# Altium schematic sheet Audio ADC.SchDoc: Vazquez Gonzalez Erick
size Letter; DrawnBy: Vazquez Gonzalez Erick; Revision: 1.0; SheetTotal: 1
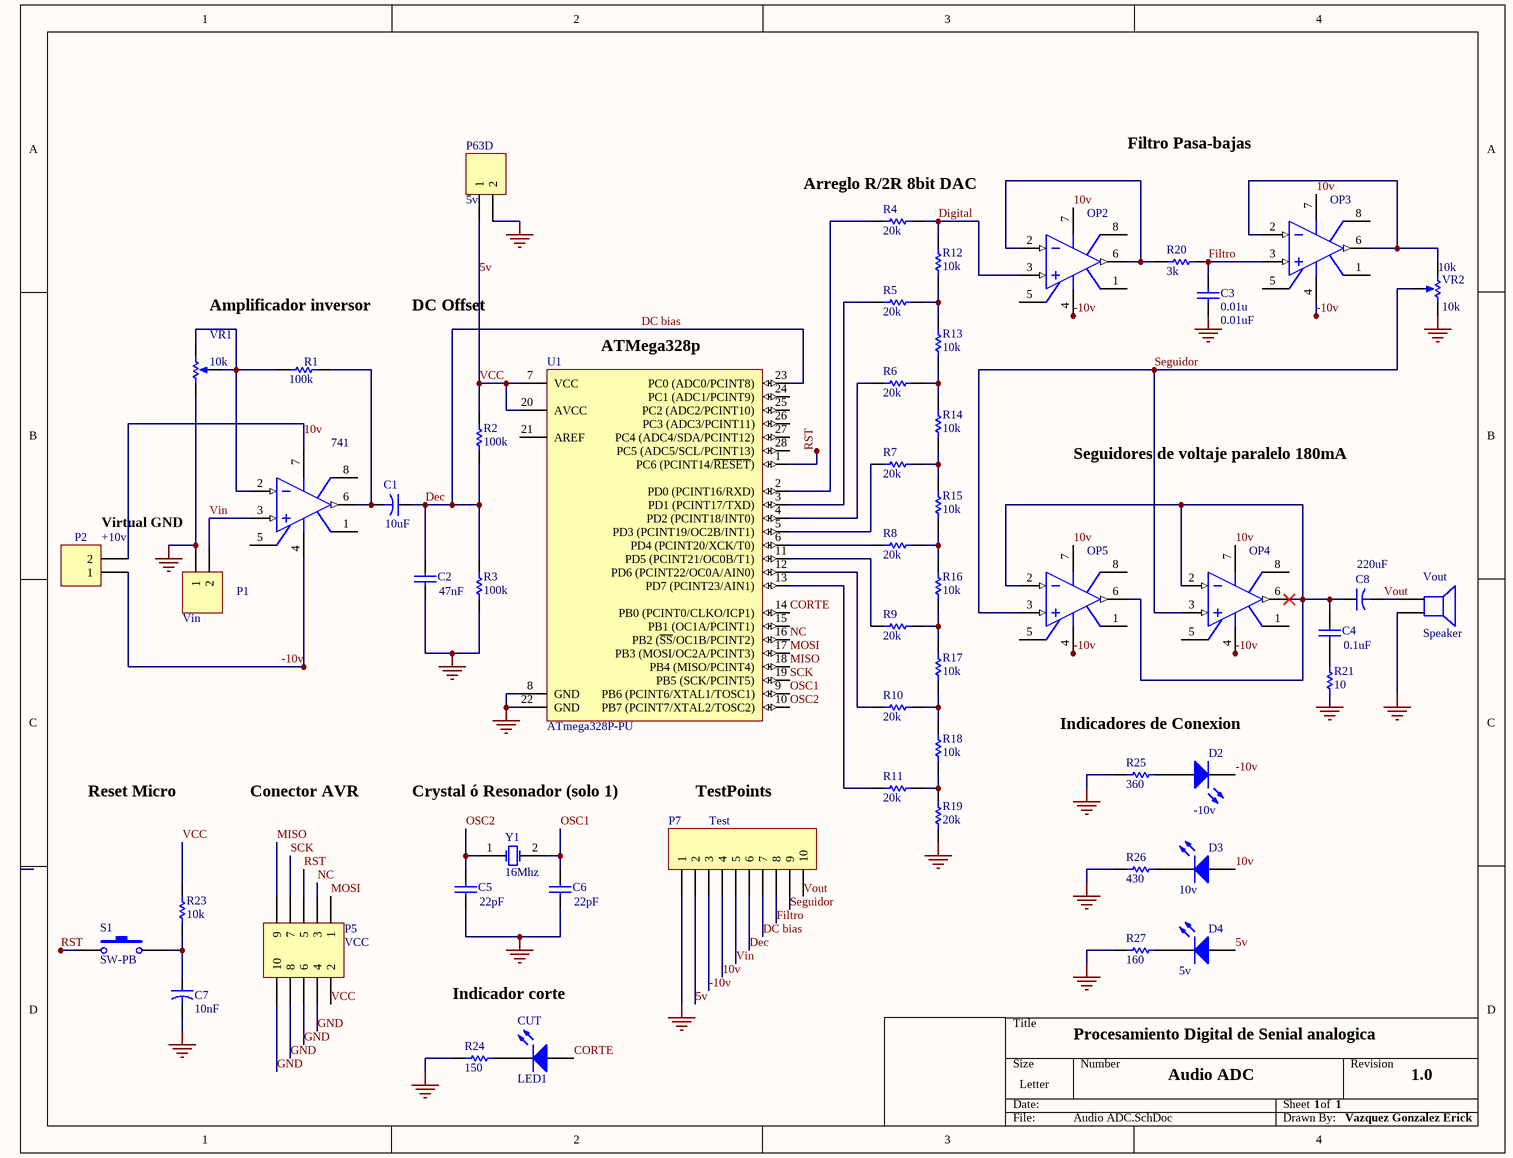
[diagram p0: Audio ADC.SchDoc]

## Parts
C1  value 10uF  [CAPR5-4X5]  (hidden comment: 10u)
C2  value 47nF  [RAD-0.2]  (hidden comment: Cap)
C3  0.01u  value 0.01uF  [RAD-0.1]
C4  value 0.1uF  [RAD-0.1]  (hidden comment: Cap)
C5  value 22pF  [RAD-0.1]  (hidden comment: 22n)
C6  value 22pF  [RAD-0.1]  (hidden comment: 22n)
C7  value 10nF  [CAPR5-4X5]  (hidden comment: 10n)
C8  value 220uF  [CAPR5-4X5]  (hidden comment: 220u)
CUT  LED1  [6-0805_M]
D2  -10v  [6-0805_M]
D3  10v  [6-0805_M]
D4  5v  [6-0805_M]
OP1  741  [DIP-8]
OP2  741  [DIP-8]  (value not drawn)
OP3  741  [DIP-8]  (value not drawn)
OP4  741  [DIP-8]  (value not drawn)
OP5  741  [DIP-8]  (value not drawn)
P1  Vin  [cONECTOR]
P2  +10v  [cONECTOR]
P5  VCC  [HDR2X5]
P7  Test  [HDR1X10]
P63D  5v  [cONECTOR]
R1  100k  [AXIAL-0.3]
R2  100k  [AXIAL-0.3]
R3  100k  [AXIAL-0.3]
R4  20k  [AXIAL-0.3]
R5  20k  [AXIAL-0.3]
R6  20k  [AXIAL-0.3]
R7  20k  [AXIAL-0.3]
R8  20k  [AXIAL-0.3]
R9  20k  [AXIAL-0.3]
R10  20k  [AXIAL-0.3]
R11  20k  [AXIAL-0.3]
R12  10k  [AXIAL-0.3]
R13  10k  [AXIAL-0.3]
R14  10k  [AXIAL-0.3]
R15  10k  [AXIAL-0.3]
R16  10k  [AXIAL-0.3]
R17  10k  [AXIAL-0.3]
R18  10k  [AXIAL-0.3]
R19  20k  [AXIAL-0.3]
R20  3k  [AXIAL-0.3]
R21  10  [AXIAL-0.3]
R23  10k  [AXIAL-0.3]
R24  150  [6-0805_M]
R25  360  [6-0805_M]
R26  430  [6-0805_M]
R27  160  [6-0805_M]
S1  SW-PB  [PBUniversal]
U1  ATmega328P-PU  [28P3]
Vout  Speaker  [cONECTOR]
VR1  10k  [TPParado]
VR2  10k  [TPParado]
Y1  16Mhz  [Crystal]

## Nets
GND: C2.1 C3.1 C5.1 C6.1 C7.2 P1.1 P5.4 P5.6 P5.8 P5.10 P7.1 P63D.2 R3.1 R19.1 R21.1 R24.1 R25.1 R26.1 R27.1 U1.8(GND) U1.22(GND) Vout.2 VR1.1(TOP) VR2.2(BOT)
5v: D4.1(A) P5.2 P7.2 P63D.1 R2.2 R23.1 U1.7(VCC) U1.20(AVCC)  [also labelled VCC]
10v: D3.1(A) OP1.7(V+) OP2.7(V+) OP3.7(V+) OP4.7(V+) OP5.7(V+) P2.2 P7.4
-10v: D2.2(K) OP1.4(V-) OP2.4(V-) OP3.4(V-) OP4.4(V-) OP5.4(V-) P2.1 P7.3
CORTE: CUT.1(A) U1.14(PB0_(PCINT0/CLKO/ICP1))
DC bias: C1.1 C2.2 P7.6 P7.7 R2.1 R3.2 U1.23(PC0_(ADC0/PCINT8))  [also labelled Dec]
Digital: OP2.3(IN+) R4.2 R12.2
Filtro: C3.2 OP3.3(IN+) P7.8 R20.1
MISO: P5.9 U1.18(PB4_(MISO/PCINT4))
MOSI: P5.1 U1.17(PB3_(MOSI/OC2A/PCINT3))
NC: P5.3 U1.16(PB2_(~{SS}/OC1B/PCINT2))
OSC1: C6.2 U1.9(PB6_(PCINT6/XTAL1/TOSC1)) Y1.2(OSC2)
OSC2: C5.2 U1.10(PB7_(PCINT7/XTAL2/TOSC2)) Y1.1(OSC1)
RST: P5.5 S1.1 U1.1(PC6_(PCINT14/~{RESET}))
SCK: P5.7 U1.19(PB5_(SCK/PCINT5))
Seguidor: OP4.3(IN+) OP5.3(IN+) P7.9 VR2.3(TAP)
Vin: OP1.3(IN+) P1.2 P7.5
Vout: C8.2 P7.10 Vout.1
NetC1_2: C1.2 OP1.6(OUT) R1.2
NetC4_1: C4.1 C8.1 OP4.2(IN-) OP4.6(OUT) OP5.2(IN-) OP5.6(OUT)
NetC4_2: C4.2 R21.2
NetC7_1: C7.1 R23.2 S1.2
NetCUT_2: CUT.2(K) R24.2
NetD2_1: D2.1(A) R25.2
NetD3_2: D3.2(K) R26.2
NetD4_2: D4.2(K) R27.2
NetOP1_2: OP1.2(IN-) R1.1 VR1.2(BOT) VR1.3(TAP)
NetOP2_2: OP2.2(IN-) OP2.6(OUT) R20.2
NetOP3_2: OP3.2(IN-) OP3.6(OUT) VR2.1(TOP)
NetR4_1: R4.1 U1.2(PD0_(PCINT16/RXD))
NetR5_1: R5.1 U1.3(PD1_(PCINT17/TXD))
NetR5_2: R5.2 R12.1 R13.2
NetR6_1: R6.1 U1.4(PD2_(PCINT18/INT0))
NetR6_2: R6.2 R13.1 R14.2
NetR7_1: R7.1 U1.5(PD3_(PCINT19/OC2B/INT1))
NetR7_2: R7.2 R14.1 R15.2
NetR8_1: R8.1 U1.6(PD4_(PCINT20/XCK/T0))
NetR8_2: R8.2 R15.1 R16.2
NetR9_1: R9.1 U1.11(PD5_(PCINT21/OC0B/T1))
NetR9_2: R9.2 R16.1 R17.2
NetR10_1: R10.1 U1.12(PD6_(PCINT22/OC0A/AIN0))
NetR10_2: R10.2 R17.1 R18.2
NetR11_1: R11.1 U1.13(PD7_(PCINT23/AIN1))
NetR11_2: R11.2 R18.1 R19.2

Not connected (* = marked no-connect by the designer): OP1 1(OS_NUL) 5(OS_NUL) 8(TAB); OP2 1(OS_NUL) 5(OS_NUL) 8(TAB); OP3 1(OS_NUL) 5(OS_NUL) 8(TAB); OP4 1(OS_NUL) 5(OS_NUL) 8(TAB); OP5 1(OS_NUL) 5(OS_NUL) 8(TAB); U1 15(PB1_(OC1A/PCINT1)) 21(AREF) 24(PC1_(ADC1/PCINT9)) 25(PC2_(ADC2/PCINT10)) 26(PC3_(ADC3/PCINT11)) 27(PC4_(ADC4/SDA/PCINT12)) 28(PC5_(ADC5/SCL/PCINT13))

## Notes on the sheet
- Filtro Pasa-bajas
- (near R4) Arreglo R/2R 8bit DAC
- Amplificador inversor
- DC Offset
- (near U1) ATMega328p
- Seguidores de voltaje paralelo 180mA
- Virtual GND
- Indicadores de Conexion
- Reset Micro
- Conector AVR
- Crystal ó Resonador (solo 1)
- TestPoints
- Indicador corte
- Procesamiento Digital de Senial analogica
- Audio ADC
- 1
- 1.0
- Vazquez Gonzalez Erick

## Library data of the parts
C1 C7 C8 = Cap2: Capacitor; Published: 23-Sep-2002; PackageReference: CAPR5-4X5; Publisher: Altium Limited; PackageDescription: Capacitor; 2 Leads
C2-C6 = Cap: Capacitor; Published: 8-Jun-2000; LatestRevisionDate: 17-Jul-2002; LatestRevisionNote: Re-released for DXP Platform.; PackageReference: RAD-0.3; Publisher: Altium Limited; PackageDescription: Radial Cap, Thru-Hole; 2 Leads; 0.3 in Pin Spacing
CUT D2-D4 = LED1: Typical RED GaAs LED; Published: 8-Jun-2000; LatestRevisionDate: 08-Jul-2005; LatestRevisionNote: Mech Layer 1 removed.; PackageReference: LED-1; Publisher: Altium Limited; PackageDescription: LED; 2 Leads
OP1-OP5 = Op Amp: FET Operational Amplifier; Published: 8-Jun-2000; LatestRevisionDate: 17-Jul-2002; LatestRevisionNote: Re-released for DXP Platform.; DatasheetVersion: REV. B; PackageVersion: 1990; PackageReference: H-08A; Publisher: Altium Limited; PackageDescription: Can; 8 Leads; Pin Circle Dia. 5.08 mm; Lead Dia. 0.53 mm (max); ComponentLink1Description: Manufacturer Link; ComponentLink1URL: http://www.analog.com/
P1 P2 P63D = MHDR1X2: Header, 2-Pin; LatestRevisionDate: 17-Jul-2002; LatestRevisionNote: Re-released for DXP Platform.; Publisher: Altium Limited
P5 = Header 5X2: Header, 5-Pin, Dual row; LatestRevisionDate: 17-Jul-2002; LatestRevisionNote: Re-released for DXP Platform.; Publisher: Altium Limited
P7 = Header 10: Header, 10-Pin; LatestRevisionDate: 17-Jul-2002; LatestRevisionNote: Re-released for DXP Platform.; Publisher: Altium Limited
R1-R3 = Res1: Resistor; Published: 8-Jun-2000; LatestRevisionDate: 17-Jul-2002; LatestRevisionNote: Re-released for DXP Platform.; PackageReference: AXIAL-0.3; Publisher: Altium Limited; PackageDescription: Axial Device, Thru-Hole; 2 Leads; 0.3 in Pin Spacing
  R1: 100k: 100k
  R2 R3: Value: 100k
R4-R21 R23-R27 = Res1: Resistor; Value: 1K; Published: 8-Jun-2000; LatestRevisionDate: 17-Jul-2002; LatestRevisionNote: Re-released for DXP Platform.; PackageReference: AXIAL-0.3; Publisher: Altium Limited; PackageDescription: Axial Device, Thru-Hole; 2 Leads; 0.3 in Pin Spacing
S1 = SW-PB: Switch; Published: 24-Mar-1999; LatestRevisionDate: 17-Jul-2002; LatestRevisionNote: Re-released for DXP Platform.; PackageReference: SPST-2; Publisher: Altium Limited; PackageDescription: Switch; 2 Leads
U1 = ATmega328P-PU: 8-bit AVR Microcontroller, 32KB Flash, 1KB EEPROM, 2KB SRAM, 28-pin PDIP, Industrial Grade (-40°C to 85°C); Published: 1-Apr-2010; DatasheetVersion: revA, Jan-2010; PackageVersion: revB, Sep-2001; PackageReference: 28P3; Publisher: Altium Limited; PackageDescription: 28-lead (0.300"/7.62mm Wide) Plastic Dual Inline Package (PDIP); Supplier 1: Digi-Key; Supplier Part Number 1: ATMEGA328P-PU-ND; Supplier 2: Farnell; Supplier Part Number 2: 1715487; Supplier 3: Mouser; Supplier Part Number 3: 556-ATMEGA328P-PU; ComponentLink1Description: Manufacturer Link; ComponentLink1URL: http://www.atmel.com/products/avr/default.asp?; ComponentLink2Description: ATmega48A/48PA/88A/88PA/168A/168PA/328/328P Datasheet; ComponentLink2URL: http://www.atmel.com/dyn/resources/prod_documents/8271.pdf; ComponentLink3Description: ATmega48A/48PA/88A/88PA/168A/168PA/328/328P Summary; ComponentLink3URL: http://www.atmel.com/dyn/resources/prod_documents/8271S.pdf; ComponentLink4Description: Atmel.com Home; ComponentLink4URL: http://www.atmel.com
Vout = Speaker: Loudspeaker; Published: 24-Mar-1999; LatestRevisionDate: 17-Jul-2002; LatestRevisionNote: Re-released for DXP Platform.; PackageReference: PIN2; Publisher: Altium Limited
VR1 VR2 = RPot: Potentiometer; Sim Note: Enter the Resistance value and the set point into parameter fields.; Set Position: 0.5; Published: 8-Jun-2000; LatestRevisionDate: 17-Jul-2002; LatestRevisionNote: Re-released for DXP Platform.; PackageReference: VR5; Publisher: Altium Limited; PackageDescription: Variable Resistor, Thru-Hole; 3 Leads; Value: 10k
Y1 = XTAL: Crystal Oscillator; Published: 8-Jun-2000; LatestRevisionDate: 17-Jul-2002; LatestRevisionNote: Re-released for DXP Platform.; PackageReference: R38; Publisher: Altium Limited; PackageDescription: Crystal, Thru-Hole; 2 Leads; Body 3.1 x 8.2 mm (Dia.xH)